# Altium project SilentBotStep.PrjPcb
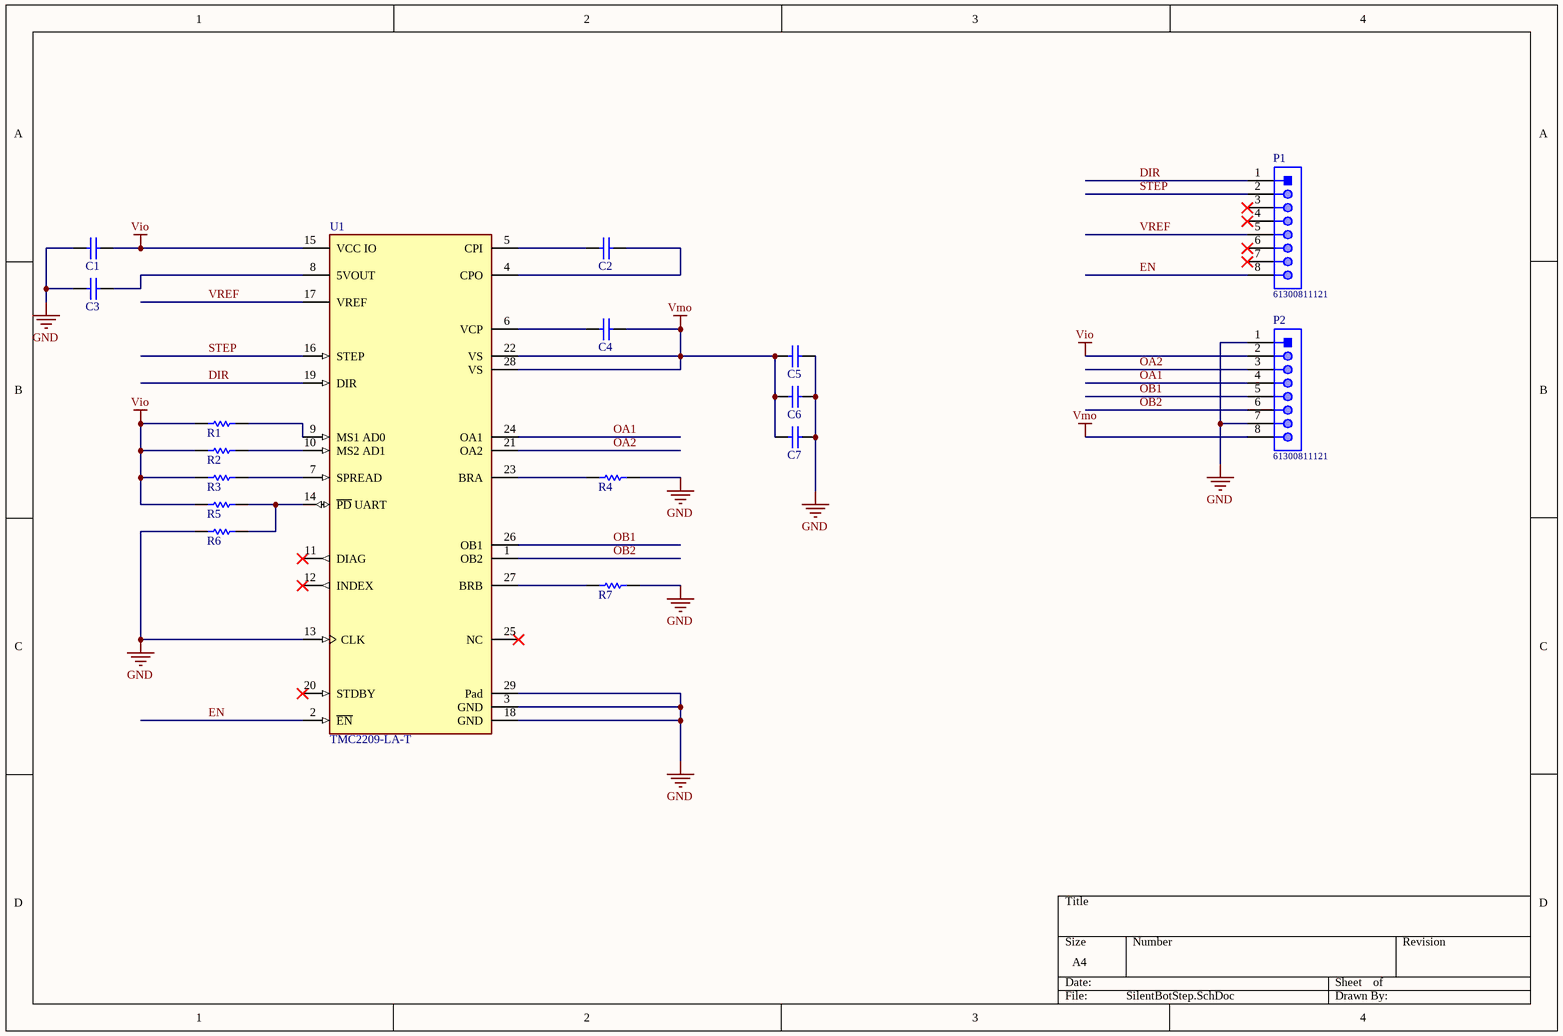
[diagram p0: SilentBotStep.SchDoc]
1 sheet, 17 parts. Net scope: global (net labels, ports and power ports of the same name join across sheets).
Board file: SilentBotStep.PcbDoc

## Sheet SilentBotStep.SchDoc
size A4

### Parts
C1  GRM155R71H104KE14D  [CAPC1005X55X25LL05T10]  (value not drawn)
C2  CC0402KRX7R9BB223  [CAPC1005X55X25LL05T10]  (value not drawn)
C3  GRM155R60J475ME47D  [CAPC1005X55X25LL05T10]  (value not drawn)
C4  GRM155R71H104KE14D  [CAPC1005X55X25LL05T10]  (value not drawn)
C5  GRM155R71H104KE14D  [CAPC1005X55X25LL05T10]  (value not drawn)
C6  GRM155R71H104KE14D  [CAPC1005X55X25LL05T10]  (value not drawn)
C7  C3216X7R1V106M160AC  [CAPC3216X180X20LL20]  (value not drawn)
P1  61300811121  [61300811121]
P2  61300811121  [61300811121]
R1  RC0402JR-070RL  [RESC1005X40X25LL05T10]  (value not drawn)
R2  RC0402JR-070RL  [RESC1005X40X25LL05T10]  (value not drawn)
R3  RC0402JR-070RL  [RESC1005X40X25LL05T10]  (value not drawn)
R4  ERJ-U6QFR27V  [RESC2013X50X40LL20T20]  (value not drawn)
R5  RC0402JR-070RL  [RESC1005X40X25LL05T10]  (value not drawn)
R6  RC0402JR-070RL  [RESC1005X40X25LL05T10]  (value not drawn)
R7  ERJ-U6QFR27V  [RESC2013X50X40LL20T20]  (value not drawn)
U1  TMC2209-LA-T  [Trinamic_0_IPC_C]

### Nets
GND: C1.1 C3.1 C5.2 C6.2 C7.2 P2.1 P2.7 R4.2 R6.1 R7.2 U1.3(GND) U1.13(CLK) U1.18(GND) U1.29(Pad)
Vio: C1.2 P2.2 R1.1 R2.1 R3.1 R5.1 U1.15(VCC_IO)
Vmo: C4.2 C5.1 C6.1 C7.1 P2.8 U1.22(VS) U1.28(VS)
DIR: P1.1 U1.19(DIR)
EN: P1.8 U1.2(~{EN})
OA1: P2.4 U1.24(OA1)
OA2: P2.3 U1.21(OA2)
OB1: P2.5 U1.26(OB1)
OB2: P2.6 U1.1(OB2)
STEP: P1.2 U1.16(STEP)
VREF: P1.5 U1.17(VREF)
NetC2_1: C2.1 U1.5(CPI)
NetC2_2: C2.2 U1.4(CPO)
NetC3_2: C3.2 U1.8(5VOUT)
NetC4_1: C4.1 U1.6(VCP)
NetR1_2: R1.2 U1.9(MS1_AD0)
NetR2_2: R2.2 U1.10(MS2_AD1)
NetR3_2: R3.2 U1.7(SPREAD)
NetR4_1: R4.1 U1.23(BRA)
NetR5_2: R5.2 R6.2 U1.14(~{PD}_UART)
NetR7_1: R7.1 U1.27(BRB)

Not connected (* = marked no-connect by the designer): P1 3* 4* 6* 7*; U1 11(DIAG)* 12(INDEX)* 20(STDBY)* 25(NC)*

### Library data of the parts
C1 C4-C6 = CMP-001-00001-1: MURATA - GRM155R71H104KE14D - CAP, MLCC, X7R, 0.1UF, 50V, 0402; Tolerance: 10%; Material: Ceramic; Capacitance: 100nF; Dissipation Factor: 0.025%; Length: 1mm; Package Quantity: 10000; Lead Free: Lead Free; Max Operating Temperature: 125°C; Dielectric: X7R; Voltage Rating (DC): 50V; Case Code (Metric): 1005; Min Operating Temperature: -55°C; Width: 0.5mm; Depth: 0.5mm; Case/Package: 0402; Packaging: Tape and Reel; REACH SVHC: No SVHC; Height: 0.5mm; Composition: Ceramic; Thickness: 0.022inch; Case Code (Imperial): 0402; Voltage: 50V; Mount: Surface Mount; Voltage Rating: 50V; Weight: 0.000212oz; Dielectric Material: Ceramic; Termination: SMD/SMT
C2 = CMP-001-00002-2: Multilayer Ceramic Capacitors MLCC - SMD/SMT 22K pF 10% 50 Volts; Dielectric: X7R; Voltage Rating: 50V; Capacitance: 22nF; Thickness: 0.022inch; Case Code (Imperial): 0402; Min Operating Temperature: -55°C; Termination: SMD/SMT; Case Code (Metric): 1005; Lead Free: Lead Free; Width: 0.02inch; Weight: 2.3E-05oz; Package Quantity: 10000; Length: 1mm; Max Operating Temperature: 125°C; Mount: Surface Mount; Tolerance: 10%; Halogen Free: Halogen Free; Packaging: Tape and Reel; Voltage Rating (DC): 50V; Composition: Ceramic; Depth: 0.5mm; Case/Package: 0402
C3 = CMP-001-00003-1: CAP CER 4.7UF 6.3V X5R 0402; Tolerance: 20%; Voltage Rating (DC): 6.3V; Lead Free: Lead Free; Package Quantity: 10000; Case/Package: 0402; REACH SVHC: No SVHC; Depth: 0.5mm; Case Code (Metric): 1005; Width: 0.02inch; Voltage: 6.3V; Max Operating Temperature: 85°C; Height: 0.5mm; Min Operating Temperature: -55°C; Weight: 0.000212oz; Mount: Surface Mount; Contact Plating: Tin; Dielectric: X5R; Capacitance: 4.7uF; Packaging: Tape and Reel; Voltage Rating: 6.3V; Case Code (Imperial): 0402; Thickness: 0.022inch; Length: 1mm; Termination: SMD/SMT
C7 = CMP-001-00000-1: CERAMIC CAPACITOR, 10UF, 35V, X7R, 1206, FULL REEL; Product Range:C Series; Capacitance:10 F; Capacitance Tolerance: 20%; Dielectric Characteristic:X7R; Voltage Rating:35V; Ceramic Capacitor Case:1206 [3216 Metric]; MSL:- ;RoHS Compliant: Yes; Packaging: Tape and Reel; REACH SVHC: No SVHC; Voltage Rating (DC): 35V; Depth: 1.6mm; Dielectric: X7R; Max Operating Temperature: 125°C; Length: 3.2mm; Thickness: 0.071inch; Height: 1.6mm; Composition: Ceramic; Case Code (Metric): 3216; Case Code (Imperial): 1206; Package Quantity: 2000; Lead Free: Lead Free; Width: 0.063inch; Weight: 0.000571oz; Termination: SMD/SMT; Capacitance: 10uF; Mount: Surface Mount; Voltage Rating: 35V; Case/Package: 1206; Dielectric Material: Ceramic; Tolerance: 20%; Min Operating Temperature: -55°C
P1 P2 = CMP-002-00000-1: Board-To-Board Connector, Vertical, Wr-Phd Series, Through Hole, Header, 8, 2.54 Mm; Number of Contacts: 8; Connector Type: Male Pin; Pitch: 0.1inch; Gender: Male; Number of Positions: 8; Color: Black; Mount: Through Hole; Number of Rows: 1; Contact Material: Copper; Termination: Solder; Packaging: Bulk; Contact Plating: Gold; Contact Mating Length: 0.236inch; REACH SVHC: Unknown
R1-R3 R5 R6 = CMP-009-00001-1: YAGEO - RC0402JR-070RL. - RES, THICK FILM, 0R, 0.0625W, 0402; Resistance: 0mR; Max Power Dissipation: 63mW; Tolerance: 5%; Power Rating: 62.5mW; Voltage Rating: 50V; Temperature Coefficient: 200ppm/°C; Depth: 0.5mm; REACH SVHC: Unknown; Termination: SMD/SMT; Number of Terminations: 2; Max Operating Temperature: 155°C; Case Code (Metric): 1005; Features: Moisture Resistant; Radiation Hardening: No; Composition: Thick Film; Military Standard: Not; Contact Plating: Tin,Matte; Case Code (Imperial): 0402; Packaging: Tape and Reel; Length: 1mm; Height: 0.016inch; Case/Package: 0402; Min Operating Temperature: -55°C; Package Quantity: 1; Lead Free: Lead Free; Width: 0.02inch
R4 R7 = CMP-009-00002-1: RES 0.27 OHM 1% 1/4W 0805; Temperature Coefficient: 150ppm/°C; Resistance: 270mR; Max Power Dissipation: 250mW; Packaging: Tape and Reel; Case Code (Imperial): 0805; Features: Automotive AEC-Q200,Anti-Sulfur; Case Code (Metric): 2012; Tolerance: 1%; Min Operating Temperature: -55°C; Max Operating Temperature: 155°C; Number of Terminations: 2; Case/Package: 0805; Composition: Thick Film
U1 = CMP-012-0001-3: Motor Driver, Stepper, QFN-28

## Assembly variants
Default: not fitted R3 R5